# EasyEDA Pro project School Vn project.eprj

# Schematic Schematic1
Board Name: Board1; Create Date: 2025-03-07; Page Name: P1; Project Name: School Vn project; Schematic Name: Schematic1; Update Date: 2025-03-07; Company: EasyEDA.com; Page Size: A4; Version: V1.0
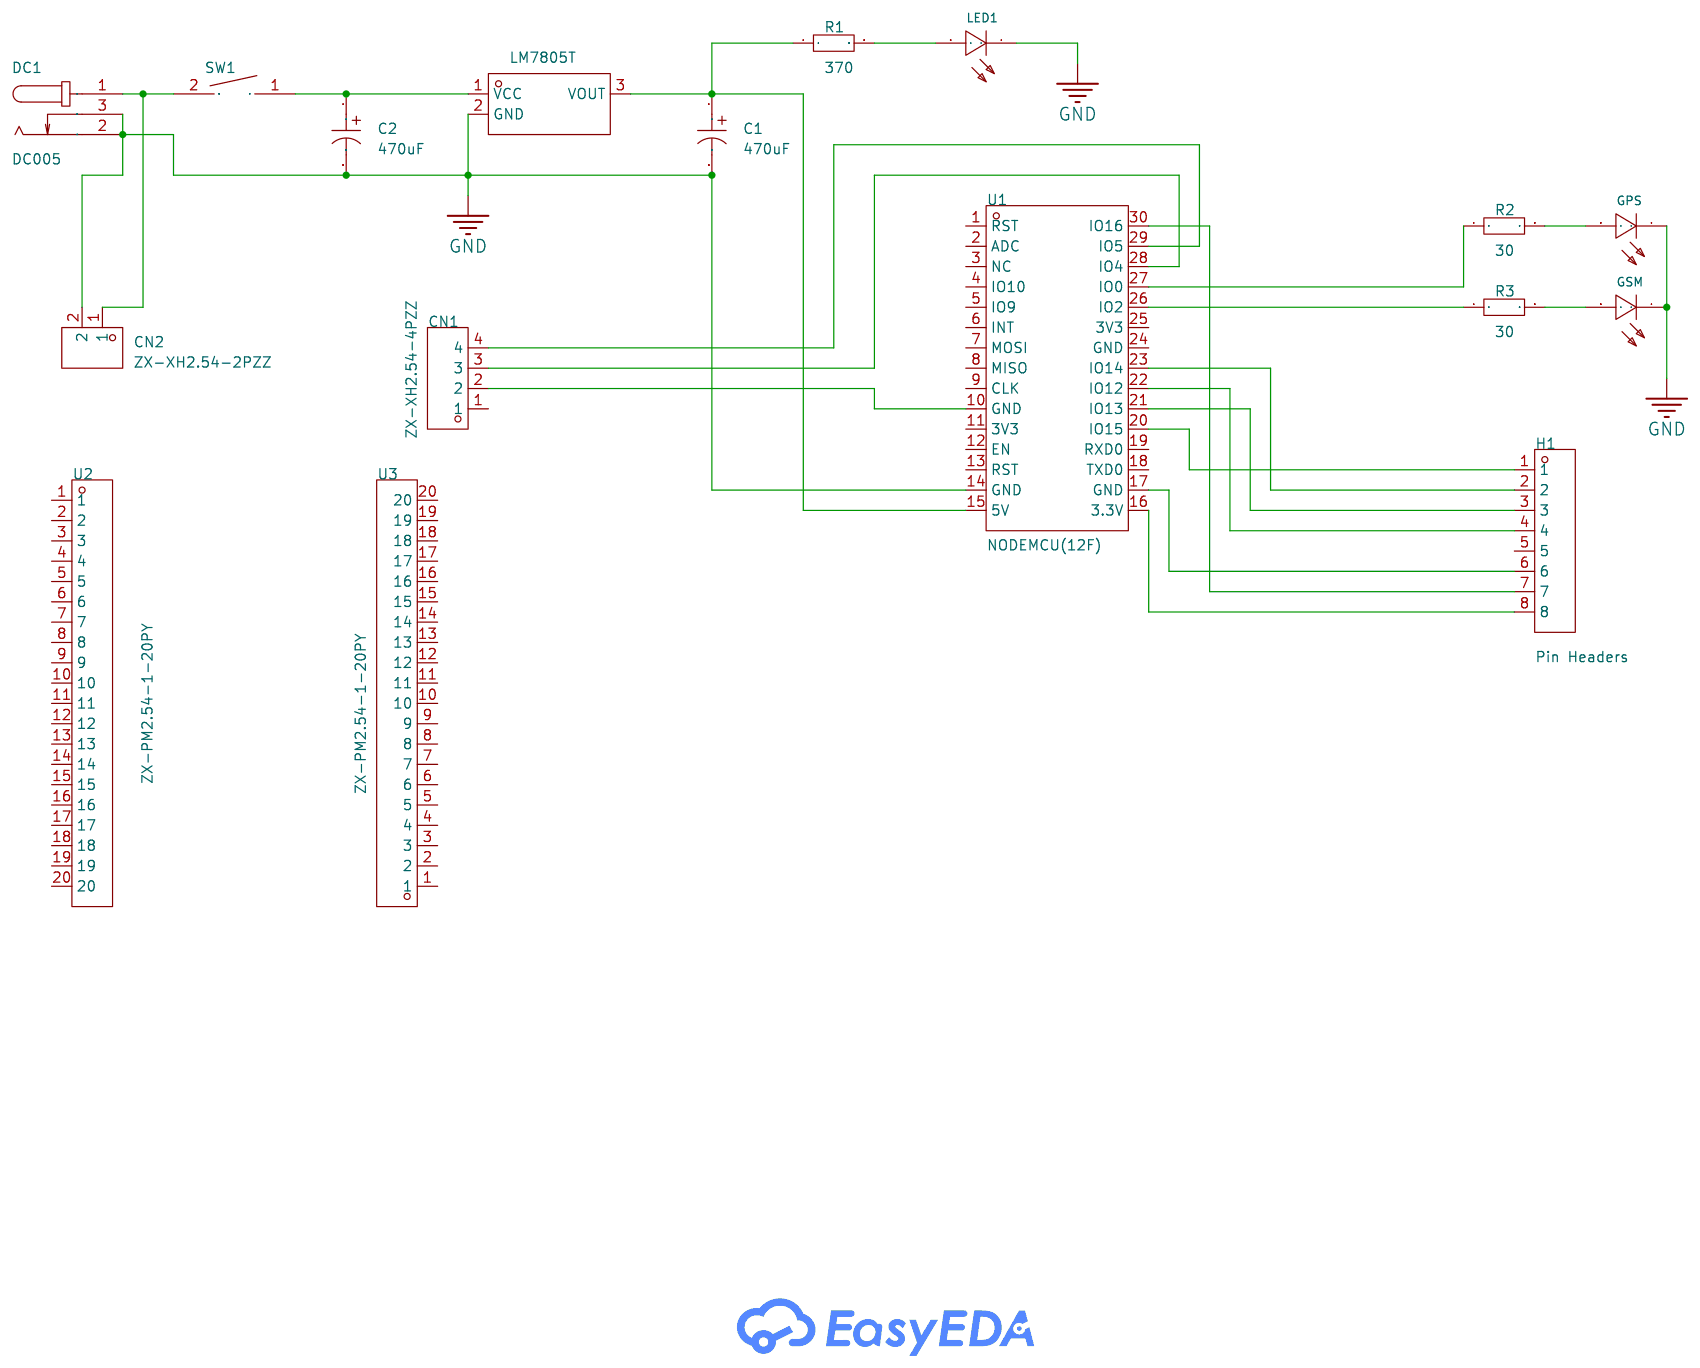
[diagram p0: schematic sheet]

## Parts
7805T  LM7805T  [TO-220-3_L10.1-W4.7-P2.54-L]
C1  470uF  [CAP-TH_BD8.0-P3.50-D0.5-FD]
C2  470uF  [CAP-TH_BD8.0-P3.50-D0.5-FD]
CN1  ZX-XH2.54-4PZZ  [CONN-TH_4P-P2.50_4PIN]
CN2  ZX-XH2.54-2PZZ  [CONN-TH_2P-P2.50_HX25003-2A]
DC1  DC005  [DC-IN-TH_DC005]
GPS  NCD0603R1  [LED0603-RD_RED]
GSM  NCD0603R1  [LED0603-RD_RED]
H1  Pin Headers  [HDR-TH_8P-P2.54-V-M]
LED1  NCD0603R1  [LED0603-RD_RED]
R1  370  [R0603]
R2  30  [R0603]
R3  30  [R0603]
SW1  RS601HL-1010011BB  [SW-TH_RS601HL-1010011BB]
U1  NODEMCU(12F)  [WIFIM-TH_NODEMCU-8266]
U2  ZX-PM2.54-1-20PY  [HDR-TH_20P-P2.54-V-F]
U3  ZX-PM2.54-1-20PY  [HDR-TH_20P-P2.54-V-F]

## Library data of the parts
7805T = LM7805T_C7432180: Supplier Part: C7432180; Manufacturer: HGSEMI(华冠); Supplier Footprint: TO-220-3; JLCPCB Part Class: Extended Part; Datasheet: https://atta.szlcsc.com/upload/public/pdf/source/20240307/E28367F2CC2BC825DF756EF02CE1AF99.pdf; Supplier: LCSC
C1 C2 = 16V470uF CD110: Capacitance: Tolerance:±20% Tolerance:±20% Rated Voltage: Lead Spacing: φD: L: Operating Temperature:-40℃~+105℃ Operating Temperature:-40℃~+105℃; LCSC Part Name: 470uF ±20% 16V; Supplier Part: C2960230; Manufacturer: HRK(鸿瑞凯电子); Supplier Footprint: 插件,D8xL12mm; JLCPCB Part Class: Extended Part; Datasheet: https://atta.szlcsc.com/upload/public/pdf/source/20220224/2CB522967B15D7F3A2A87609BAADB3FE.pdf; Supplier: LCSC; Tolerance: ±20%; Operating Temperature: -40℃~+105℃
CN1 = ZX-XH2.54-4PZZ: Pins Structure:1x4P Pitch:2.5mm Mounting Type:Direct Insert Reference Series:XH Number of Pins:4P Number of Rows:1 Number of PINs Per Row:4 Row Spacing:- Rated Current:3A Contact Material:Brass Contact Plating:Tin Operating Temperature:-25℃~+85℃ Operating; LCSC Part Name: 1x4P 间距:2.5mm 直插 系列:XH; Supplier Part: C7429634; Manufacturer: Megastar(兆星); Supplier Footprint: 插件,P=2.5mm; JLCPCB Part Class: Extended Part; Datasheet: https://atta.szlcsc.com/upload/public/pdf/source/20230619/B529A2163E0159A644AB3383D208FB03.pdf; Supplier: LCSC; Pins Structure: 1x4P; Pitch: 2.5mm; Mounting Type: Direct Insert; Reference Series: XH; Number of Pins: 4P; Number of Rows: 1; Number of PINs Per Row: 4; Rated Current: 3A; Contact Material: Brass; Contact Plating: Tin; Operating Temperature: -25℃~+85℃; Rated Voltage (Max): 250V; Plastic Material: PA66; Flame Retardant Rating: UL94V-0; Color: White; Z-Height of the Board: 7mm; X-Length of Bottom Edge on Board (Spacing Line): 12.5mm; Y-Width of Bottom Edge on Board: 5.9mm
CN2 = ZX-XH2.54-2PZZ: Pins Structure:1x2P Pitch:2.5mm Mounting Type:Direct Insert Reference Series:XH Number of Pins:2P Number of Rows:1 Number of PINs Per Row:2 Row Spacing:- Rated Current:3A Contact Material:Brass Contact Plating:Tin Operating Temperature:-25℃~+85℃ Operating; LCSC Part Name: 1x2P 间距:2.5mm 直插 系列:XH; Supplier Part: C7429632; Manufacturer: Megastar(兆星); Supplier Footprint: 插件,P=2.5mm; JLCPCB Part Class: Extended Part; Datasheet: https://atta.szlcsc.com/upload/public/pdf/source/20230619/19BA6947230AA44A04D3EDD65E618FD0.pdf; Supplier: LCSC; Pins Structure: 1x2P; Pitch: 2.5mm; Mounting Type: Direct Insert; Reference Series: XH; Number of Pins: 2P; Number of Rows: 1; Number of PINs Per Row: 2; Rated Current: 3A; Contact Material: Brass; Contact Plating: Tin; Operating Temperature: -25℃~+85℃; Rated Voltage (Max): 250V; Plastic Material: PA66; Flame Retardant Rating: UL94V-0; Color: White; Z-Height of the Board: 7mm; X-Length of Bottom Edge on Board (Spacing Line): 7.5mm; Y-Width of Bottom Edge on Board: 5.9mm
DC1 = DC005: Connector Type:DC Power Receptacle Mounting Style:Bend-in Inside Contact Diameter:2mm Outside Contact Diameter:6.3mm Current Rating (Max):500mA Voltage Rating (Max):30V Operating Temperature Range:-25℃~+70℃ Operating Temperature Range:-25℃~+70℃; LCSC Part Name: DC电源插座 内径:2mm 外径:6.3mm; Supplier Part: C431533; Manufacturer: SHOU HAN(首韩); Supplier Footprint: 插件; JLCPCB Part Class: Extended Part; Datasheet: https://atta.szlcsc.com/upload/public/pdf/source/20190925/C431533_4751811035784AC1D38EBC85F7905E99.pdf; Supplier: LCSC; Connector Type: DC Power Receptacle; Mounting Style: Bend-in; Inside Contact Diameter: 2mm; Outside Contact Diameter: 6.3mm; Current Rating (Max): 500mA; Voltage Rating (Max): 30V; Operating Temperature Range: -25℃~+70℃
GPS GSM LED1 = NCD0603R1_C84263: Lamp Holder Type:- Emitted Color:Red Forward Voltage (VF):1.6V~2.6V Forward Voltage (VF):1.6V~2.6V Power Dissipation:65mW Forward Current:20mA Dominant Wavelength:615nm~630nm Dominant Wavelength:615nm~630nm Peak Wavelength:- Diode Configuration:独立二极管 Lens; Supplier Part: C84263; Manufacturer: 国星光电; Supplier Footprint: 0603; JLCPCB Part Class: Extended Part; Datasheet: https://atta.szlcsc.com/upload/public/pdf/source/20200820/C84263_DABC6A75E58F576973B407FDBA283D60.pdf; Supplier: LCSC; Emitted Color: Red; Forward Voltage (VF): 1.6V~2.6V; Power Dissipation: 65mW; Forward Current: 20mA; Dominant Wavelength: 615nm~630nm; Diode Configuration: 独立二极管; Lens Color: 无色透明透镜; Luminous Intensity: 80mcd~220mcd; Viewing Angle: 130°; Operating Temperature: -30℃~+85℃
H1 = PZ254V-11-08P: Pin Structure:1x8P Pitch:2.54mm Row Spacing:- Circluar Pins/Square Pins:Square Pins Mounting Type:Straight Number of Rows:Plugin Number of Pins:8P Current Rating (Max):- Voltage Rating (Max):- Length of Mating Pin:6mm Insulation Height:2.5mm Length of End; LCSC Part Name: 间距:2.54mm 1x8P 直插 方针; Supplier Part: C492407; Manufacturer: XFCN(兴飞); Supplier Footprint: 插件,P=2.54mm; JLCPCB Part Class: Extended Part; Datasheet: https://atta.szlcsc.com/upload/public/pdf/source/20200309/C492407_83A6FB26A2233368EDB9516968EC6149.pdf; Supplier: LCSC; Pin Structure: 1x8P; Pitch: 2.54mm; Circluar Pins/Square Pins: Square Pins; Mounting Type: Straight; Number of Rows: Plugin; Number of Pins: 8P; Length of Mating Pin: 6mm; Insulation Height: 2.5mm; Length of End Connection Pin: 3mm; Operating Temperature Range: -40℃~+105℃; Color: Black
R1-R3 = Res_0603: Supplier Footprint: 0603
SW1 = RS601HL-1010011BB: Switch Length:15mm Switch Width:10.5mm Switch Height:11.7mm Actuator Type:凹Sided弯曲 With Lamp:No Pin Style:Solder Lug Actuator Color:Black Contact Current:3A Voltage Rating (AC):250V Voltage Rating (DC):- Circuit:SPST Mechanical Life:1万次 Operating Temperat; Supplier Part: C2885782; Manufacturer: HCTL(华灿天禄); Supplier Footprint: 插件; JLCPCB Part Class: Extended Part; Datasheet: https://atta.szlcsc.com/upload/public/pdf/source/20210820/B1970E40D09304D7FA648AE2099FB3E8.pdf; Supplier: LCSC; Switch Length: 15mm; Switch Width: 10.5mm; Switch Height: 11.7mm; Actuator Type: 凹Sided弯曲; With Lamp: No; Pin Style: Solder Lug; Actuator Color: Black; Contact Current: 3A; Voltage Rating (AC): 250V; Circuit: SPST; Mechanical Life: 1万次; Operating Temperature: -25℃~+85℃; Actuator Identifier: - O
U1 = NODEMCU(12F): CPU:- ROM Size:- Number of I/O: USB:- WIFI Protocols:- Bluetooth:- Ethernet:- Audio & Video Interface:- Multimedia Support:- Card Type:- Power Supply Type:- Power Supply:- POE Support:- Resolution:- Temperature Range:-; LCSC Part Name: wifi测试板 NODEMCU (12F); Supplier Part: C2764098; Manufacturer: Ai-Thinker(安信可); JLCPCB Part Class: Extended Part; Datasheet: https://atta.szlcsc.com/upload/public/pdf/source/20210401/C2764073_24755F314752A2828420B4B3FC3498D8.pdf; Supplier: LCSC
U2 U3 = ZX-PM2.54-1-20PY: Holes Structure:1x20P Pitch:2.54mm Row Spacing:- Circular Hole / Square Hole:Square Hole Mounting Type:Direct Insert Number of Rows:Single Row Number of Holes:20P Current Rating (Max):- Voltage Rating (Max):1kV Holes Direction:Top Insulation Height:8.5mm; LCSC Part Name: 1x20P 间距:2.54mm 直插; Supplier Part: C7499336; Manufacturer: Megastar(兆星); Supplier Footprint: 插件,P=2.54mm; JLCPCB Part Class: Extended Part; Datasheet: https://atta.szlcsc.com/upload/public/pdf/source/20231122/D07E8E83FD020EE141D56DDF9758AF41.pdf; Supplier: LCSC; Holes Structure: 1x20P; Pitch: 2.54mm; Circular Hole / Square Hole: Square Hole; Mounting Type: Direct Insert; Number of Rows: Single Row; Number of Holes: 20P; Voltage Rating (Max): 1kV; Holes Direction: Top; Insulation Height: 8.5mm; Contact Plating: Gold; Operating Temperature Range: -40℃~+105℃

## Nets
GND: 7805T.2(GND) C1.2 C2.2 CN2.2 DC1.2 DC1.3 GPS.1(K) GSM.1(K) LED1.1(K) U1.14(GND)
Net-(7805T-1): 7805T.1(VCC) C2.1 SW1.1
Net-(7805T-3): 7805T.3(VOUT) C1.1 R1.1 U1.15(5V)
Net-(CN1-2): CN1.2 U1.10(GND)
Net-(CN1-3): CN1.3 U1.28(IO4)
Net-(CN1-4): CN1.4 U1.29(IO5)
Net-(CN2-1): CN2.1 DC1.1 SW1.2
Net-(GPS-2): GPS.2(A) R2.2
Net-(GSM-2): GSM.2(A) R3.2
Net-(H1-1): H1.1 U1.20(IO15)
Net-(H1-2): H1.2 U1.23(IO14)
Net-(H1-3): H1.3 U1.21(IO13)
Net-(H1-4): H1.4 U1.22(IO12)
Net-(H1-6): H1.6 U1.17(GND)
Net-(H1-7): H1.7 U1.30(IO16)
Net-(H1-8): H1.8 U1.16(3.3V)
Net-(LED1-2): LED1.2(A) R1.2
Net-(R2-1): R2.1 U1.27(IO0)
Net-(R3-1): R3.1 U1.26(IO2)

Not connected (* = marked no-connect by the designer): CN1 1; H1 5; U1 1(RST) 2(ADC) 3(NC) 4(IO10) 5(IO9) 6(INT) 7(MOSI) 8(MISO) 9(CLK) 11(3V3) 12(EN) 13(RST) 18(TXD0) 19(RXD0) 24(GND) 25(3V3); U2 1 2 3 4 5 6 7 8 9 10 11 12 13 14 15 16 17 18 19 20; U3 1 2 3 4 5 6 7 8 9 10 11 12 13 14 15 16 17 18 19 20
